# Altium schematic sheet Sheet1.SchDoc
size A4
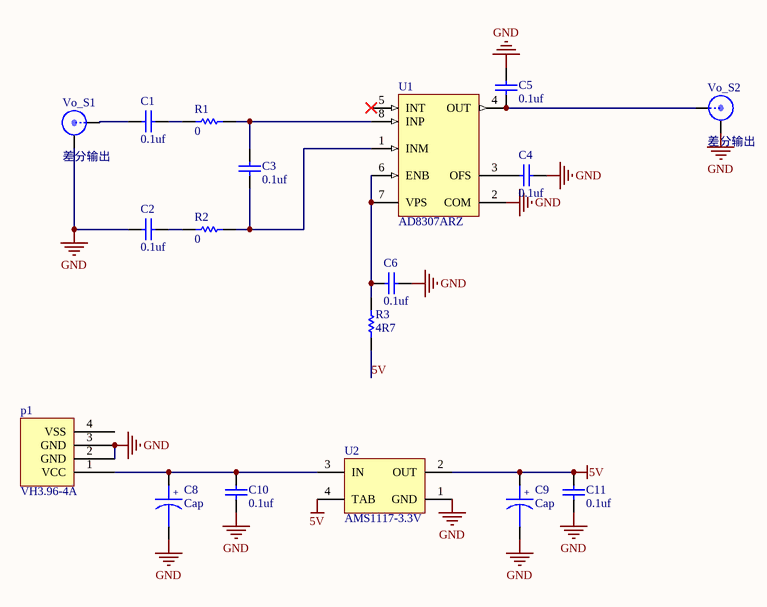
[diagram p0: Sheet1.SchDoc]

## Parts
C1  0.1uf  [0603C]
C2  0.1uf  [0603C]
C3  0.1uf  [0603C]
C4  0.1uf  [0805]
C5  0.1uf  [0805]
C6  0.1uf  [0805]
C8  Cap  [3216C-TYPE_A]
C9  Cap  [3216C-TYPE_A]
C10  0.1uf  [0805]
C11  0.1uf  [0805]
p1  VH3.96-4A  [VH3.96-4P]
R1  0  [0603R]
R2  0  [0603R]
R3  4R7  [0805]
U1  AD8307ARZ  [ADI-R-8_N]
U2  AMS1117-3.3V  [SOT-223]
Vo_S1  差分输出  [SMA-LYING]
Vo_S2  差分输出  [SMA-LYING]

## Nets
5V: C9.1 C11.2 R3.1 U2.2(OUT) U2.4(TAB)
GND: C2.1 C4.2 C5.2 C6.2 C8.2 C9.2 C10.1 C11.1 p1.2(GND) p1.3(GND) U1.2(COM) U2.1(GND) Vo_S1.1 Vo_S2.1
NetC1_1: C1.1 Vo_S1.0
NetC1_2: C1.2 R1.1
NetC2_2: C2.2 R2.1
NetC3_1: C3.1 R2.2 U1.1(INM)
NetC3_2: C3.2 R1.2 U1.8(INP)
NetC4_1: C4.1 U1.3(OFS)
NetC5_1: C5.1 U1.4(OUT) Vo_S2.0
NetC6_1: C6.1 R3.2 U1.6(ENB) U1.7(VPS)
NetC8_1: C8.1 C10.2 p1.1(VCC) U2.3(IN)

Not connected (* = marked no-connect by the designer): p1 4(VSS); U1 5(INT)*

## Notes on the sheet
- (in symbol Tantalium Cap) +

## Library data of the parts
C1-C6 C10 C11 = Cap
C8 C9 = Tantalium Cap
R1-R3 = Res
U1 = AD8307ARZ: Low Cost, DC to 500 MHz, 92 dB Logarithmic Amplifier, 400ns Response Time, R-8, Pb-Free, 98 Tube; Product Description: High Dynamic Range; Dynamic Range (dB): 92dB; Temp Stability (dB): 1dB; Voltage Supply (V): 2.7 to 5.5; Supply Current: 8mA; DatasheetVersion: Rev. D; PackageVersion: 060506-A; PackageReference: R-8; PackageDescription: 8-Lead Standard Small Outline Package [SOIC_N]; RF Frequency (MHz): dc to 500; Response Time (ns typ): 400ns; Code_JEDEC: MS-012-AA; ComponentLink1Description: Manufacturer URL; ComponentLink1URL: www.analog.com; ComponentLink2Description: Datasheet; ComponentLink2URL: http://www.analog.com/static/imported-files/data_sheets/AD8307.pdf; ComponentLink3Description: Package Specification; ComponentLink3URL: http://www.analog.com/static/imported-files/packages/PKG_PDF/SOIC_Narrow%20(R)/R_8.pdf
Vo_S1 Vo_S2 = SMA